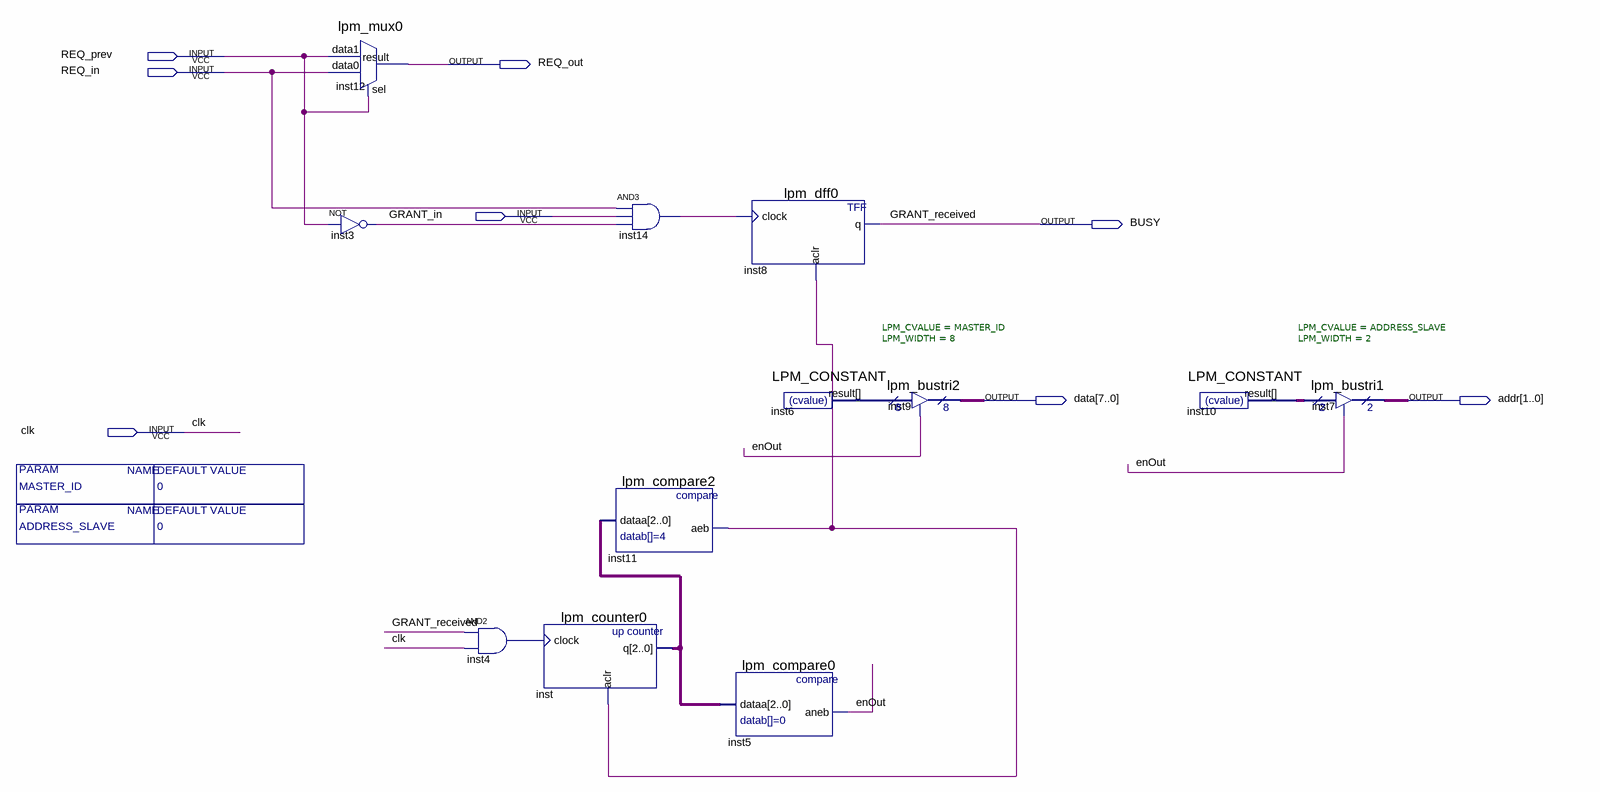
[diagram p0: schematic sheet]
// Quartus schematic master.bdf as structural Verilog: 12 symbols, 8 pins
module master #(parameter MASTER_ID = 0, parameter ADDRESS_SLAVE = 0) (
  input  REQ_prev,
  input  REQ_in,
  input  GRANT_in,
  input  clk,
  output REQ_out,
  output BUSY,
  output [7:0] data,
  output [1:0] addr
);

  wire enOut, inst3_out, inst4_out, inst11_aeb, inst14_out;
  wire [1:0] inst10_result;
  wire [2:0] inst_q;
  wire [7:0] inst6_result;

  lpm_mux0 inst12 (.data1(REQ_prev), .data0(REQ_in), .sel(REQ_prev), .result(REQ_out));
  not inst3 (inst3_out, REQ_prev);
  and inst4 (inst4_out, BUSY, clk);
  lpm_counter0 inst (.clock(inst4_out), .aclr(inst11_aeb), .q(inst_q));
  and inst14 (inst14_out, REQ_in, GRANT_in, inst3_out);
  lpm_compare2 inst11 (.dataa(inst_q), .aeb(inst11_aeb));
  lpm_dff0 inst8 (.clock(inst14_out), .aclr(inst11_aeb), .q(BUSY));
  lpm_compare0 inst5 (.dataa(inst_q), .aneb(enOut));
  LPM_CONSTANT #(.LPM_CVALUE(MASTER_ID), .LPM_WIDTH(8)) inst6 (.result(inst6_result));
  lpm_bustri2 inst9 (.enabledt(enOut), .data(inst6_result), .tridata(data));
  LPM_CONSTANT #(.LPM_CVALUE(ADDRESS_SLAVE), .LPM_WIDTH(2)) inst10 (.result(inst10_result));
  lpm_bustri1 inst7 (.enabledt(enOut), .data(inst10_result), .tridata(addr));

  // Other names for the same wires on the sheet: GRANT_received = BUSY
endmodule
